# Altium schematic sheet STM32G030K8T6.schdoc
size 68 x 68 mm
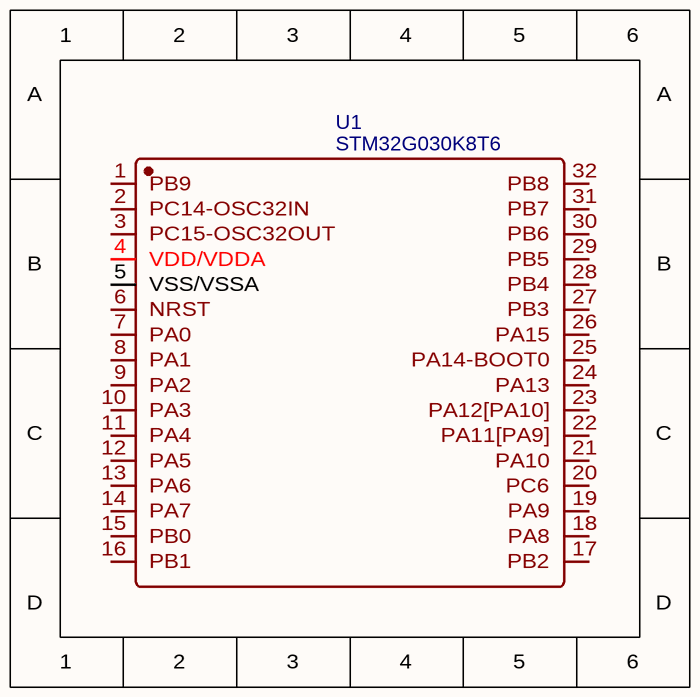
[diagram p0: STM32G030K8T6.schdoc]

## Parts
U1  STM32G030K8T6  [LQFP-32_L7.0-W7.0-P0.80-LS9.0-BL]

## Nets

Not connected (* = marked no-connect by the designer): U1 1(PB9) 2(PC14-OSC32IN) 3(PC15-OSC32OUT) 4(VDD/VDDA) 5(VSS/VSSA) 6(NRST) 7(PA0) 8(PA1) 9(PA2) 10(PA3) 11(PA4) 12(PA5) 13(PA6) 14(PA7) 15(PB0) 16(PB1) 17(PB2) 18(PA8) 19(PA9) 20(PC6) 21(PA10) 22(PA11[PA9]) 23(PA12[PA10]) 24(PA13) 25(PA14-BOOT0) 26(PA15) 27(PB3) 28(PB4) 29(PB5) 30(PB6) 31(PB7) 32(PB8)

## Library data of the parts
U1 = STM32G030K8T6: Manufacturer: ST(意法半导体); Contributor: LCSC; Supplier: LCSC; Supplier Part: C431631; Manufacturer Part: STM32G030K8T6; JLCPCB Part Class: Extended Part; spicePre: U; spiceSymbolName: STM32G030K8T6